# Altium schematic sheet IMU.SchDoc
size A; SheetNumber: 3; SheetTotal: 3
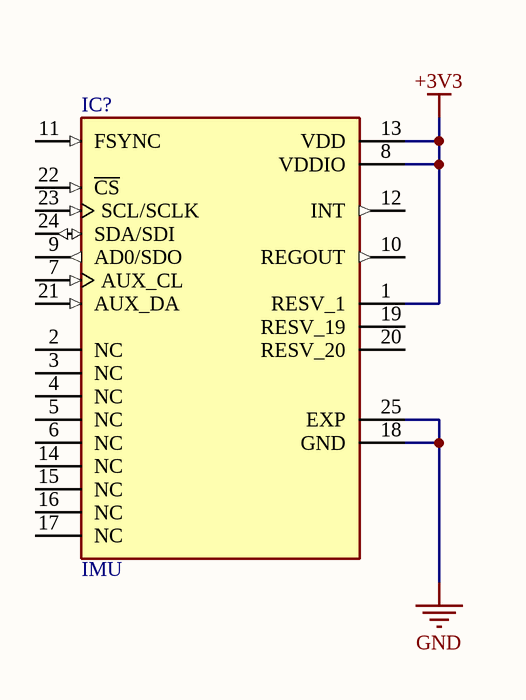
[diagram p0: IMU.SchDoc]

## Parts
IC?  IMU  [QFN24]

## Nets
+3V3: IC?.1(RESV_1) IC?.8(VDDIO) IC?.13(VDD)
GND: IC?.18(GND) IC?.25(EXP)

Not connected (* = marked no-connect by the designer): IC? 2(NC) 3(NC) 4(NC) 5(NC) 6(NC) 7(AUX_CL) 9(AD0/SDO) 10(REGOUT) 11(FSYNC) 12(INT) 14(NC) 15(NC) 16(NC) 17(NC) 19(RESV_19) 20(RESV_20) 21(AUX_DA) 22(~{CS}) 23(SCL/SCLK) 24(SDA/SDI)

## Library data of the parts
IC? = MPU9250